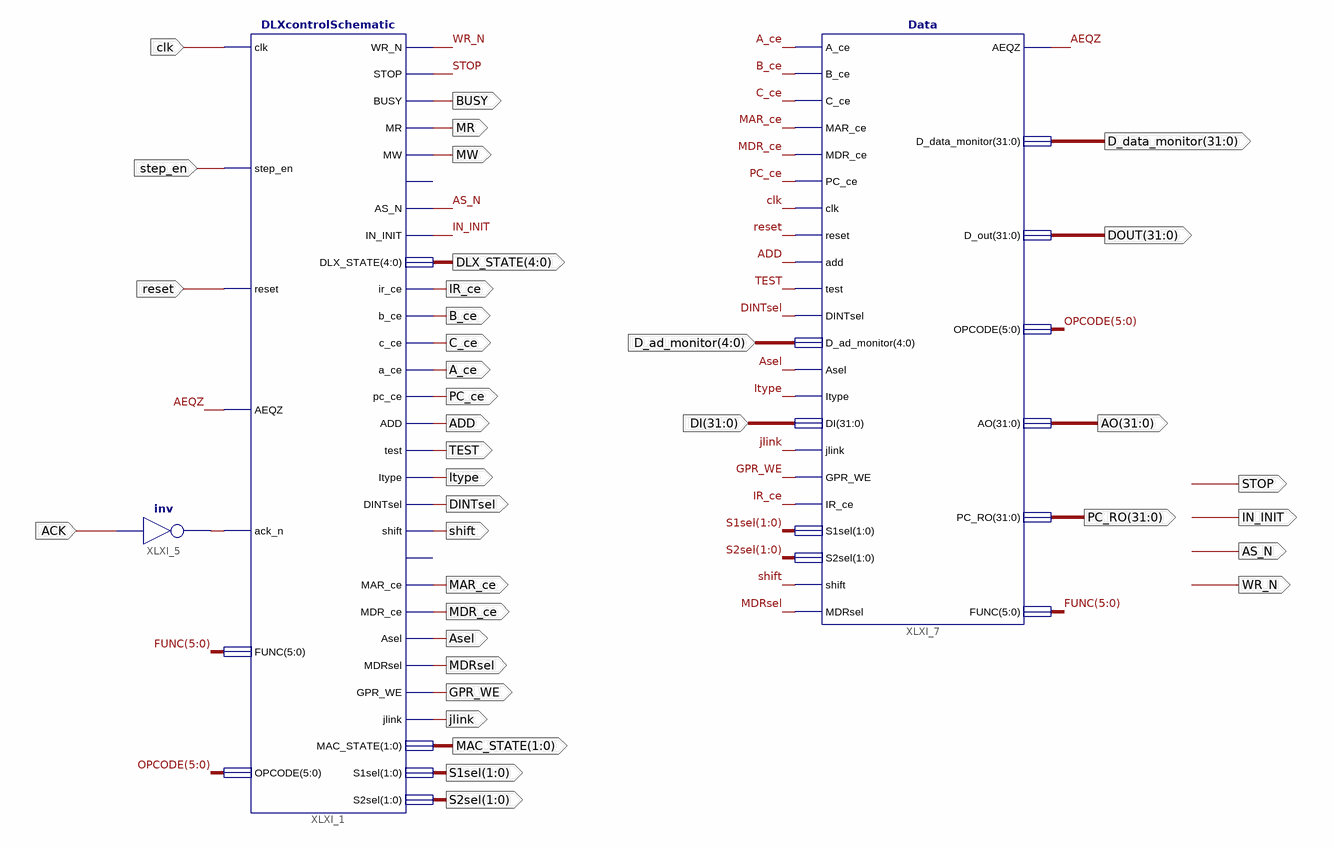
[diagram p0: schematic sheet 1]
// Xilinx ISE schematic FULL_DLX.sch (spartan3) as structural Verilog: 3 symbols, 37 ports
module FULL_DLX (
  input  clk,
  input  reset,
  input  step_en,
  input  ACK,
  input  [31:0] DI,
  input  [4:0] D_ad_monitor,
  output STOP,
  output [31:0] AO,
  output [31:0] DOUT,
  output [31:0] D_data_monitor,
  output IN_INIT,
  output AS_N,
  output WR_N,
  output IR_ce,
  output B_ce,
  output C_ce,
  output A_ce,
  output PC_ce,
  output TEST,
  output Itype,
  output DINTsel,
  output shift,
  output MAR_ce,
  output MDR_ce,
  output Asel,
  output MDRsel,
  output GPR_WE,
  output jlink,
  output [1:0] S1sel,
  output [1:0] S2sel,
  output ADD,
  output BUSY,
  output MR,
  output MW,
  output [4:0] DLX_STATE,
  output [1:0] MAC_STATE,
  output [31:0] PC_RO
);

  wire AEQZ, XLXN_46;
  wire [5:0] FUNC, OPCODE;

  DLXcontrolSchematic XLXI_1 (
    .clk(clk), .step_en(step_en), .reset(reset), .AEQZ(AEQZ), .ack_n(XLXN_46), .FUNC(FUNC), .OPCODE(OPCODE),
    .WR_N(WR_N), .STOP(STOP), .BUSY(BUSY), .MR(MR), .MW(MW), .AS_N(AS_N), .IN_INIT(IN_INIT),
    .DLX_STATE(DLX_STATE), .ir_ce(IR_ce), .b_ce(B_ce), .c_ce(C_ce), .a_ce(A_ce), .pc_ce(PC_ce), .ADD(ADD),
    .test(TEST), .Itype(Itype), .DINTsel(DINTsel), .shift(shift), .MAR_ce(MAR_ce), .MDR_ce(MDR_ce),
    .Asel(Asel), .MDRsel(MDRsel), .GPR_WE(GPR_WE), .jlink(jlink), .MAC_STATE(MAC_STATE), .S1sel(S1sel),
    .S2sel(S2sel));  // open: MAC_STOP, right
  not XLXI_5 (XLXN_46, ACK);
  Data XLXI_7 (
    .A_ce(A_ce), .B_ce(B_ce), .C_ce(C_ce), .MAR_ce(MAR_ce), .MDR_ce(MDR_ce), .PC_ce(PC_ce), .clk(clk),
    .reset(reset), .add(ADD), .test(TEST), .DINTsel(DINTsel), .D_ad_monitor(D_ad_monitor), .Asel(Asel),
    .Itype(Itype), .DI(DI), .jlink(jlink), .GPR_WE(GPR_WE), .IR_ce(IR_ce), .S1sel(S1sel), .S2sel(S2sel),
    .shift(shift), .MDRsel(MDRsel), .AEQZ(AEQZ), .D_data_monitor(D_data_monitor), .D_out(DOUT),
    .OPCODE(OPCODE), .AO(AO), .PC_RO(PC_RO), .FUNC(FUNC));
endmodule
